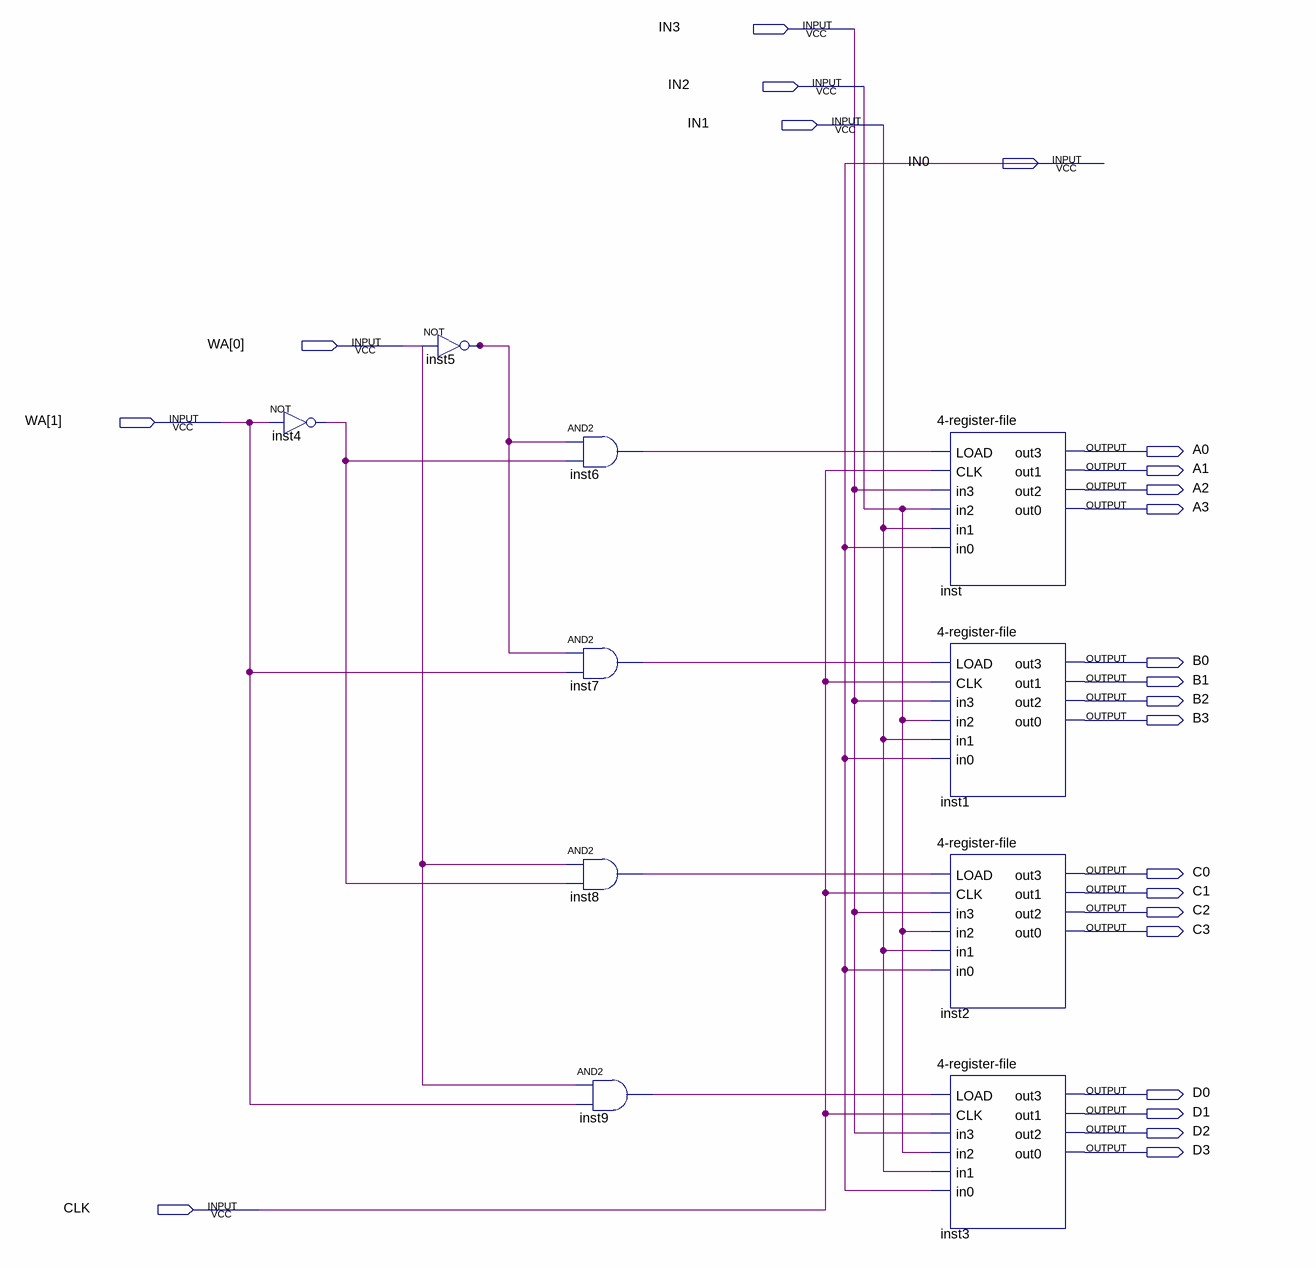
[diagram p0: schematic sheet]
// Quartus schematic 4REGFuLL.bdf as structural Verilog: 10 symbols, 23 pins
module \4REGFuLL  (
  input  IN3,
  input  IN2,
  input  IN1,
  input  IN0,
  input  [1:0] WA,
  input  CLK,
  output A0,
  output A1,
  output A2,
  output A3,
  output B0,
  output B1,
  output B2,
  output B3,
  output C0,
  output C1,
  output C2,
  output C3,
  output D0,
  output D1,
  output D2,
  output D3
);

  wire inst4_out, inst5_out, inst6_out, inst7_out, inst8_out, inst9_out;

  not inst4 (inst4_out, WA[1]);
  not inst5 (inst5_out, WA[0]);
  and inst6 (inst6_out, inst5_out, inst4_out);
  and inst7 (inst7_out, inst5_out, WA[1]);
  and inst8 (inst8_out, WA[0], inst4_out);
  and inst9 (inst9_out, WA[0], WA[1]);
  \4-register-file  inst (
    .LOAD(inst6_out), .CLK(CLK), .in3(IN3), .in2(IN2), .in1(IN1), .in0(IN0), .out3(A0), .out1(A1), .out2(A2),
    .out0(A3));
  \4-register-file  inst1 (
    .LOAD(inst7_out), .CLK(CLK), .in3(IN3), .in2(IN2), .in1(IN1), .in0(IN0), .out3(B0), .out1(B1), .out2(B2),
    .out0(B3));
  \4-register-file  inst2 (
    .LOAD(inst8_out), .CLK(CLK), .in3(IN3), .in2(IN2), .in1(IN1), .in0(IN0), .out3(C0), .out1(C1), .out2(C2),
    .out0(C3));
  \4-register-file  inst3 (
    .LOAD(inst9_out), .CLK(CLK), .in3(IN3), .in2(IN2), .in1(IN1), .in0(IN0), .out3(D0), .out1(D1), .out2(D2),
    .out0(D3));
endmodule
